# EAGLE design barriere_IR (EAGLE 6.1)
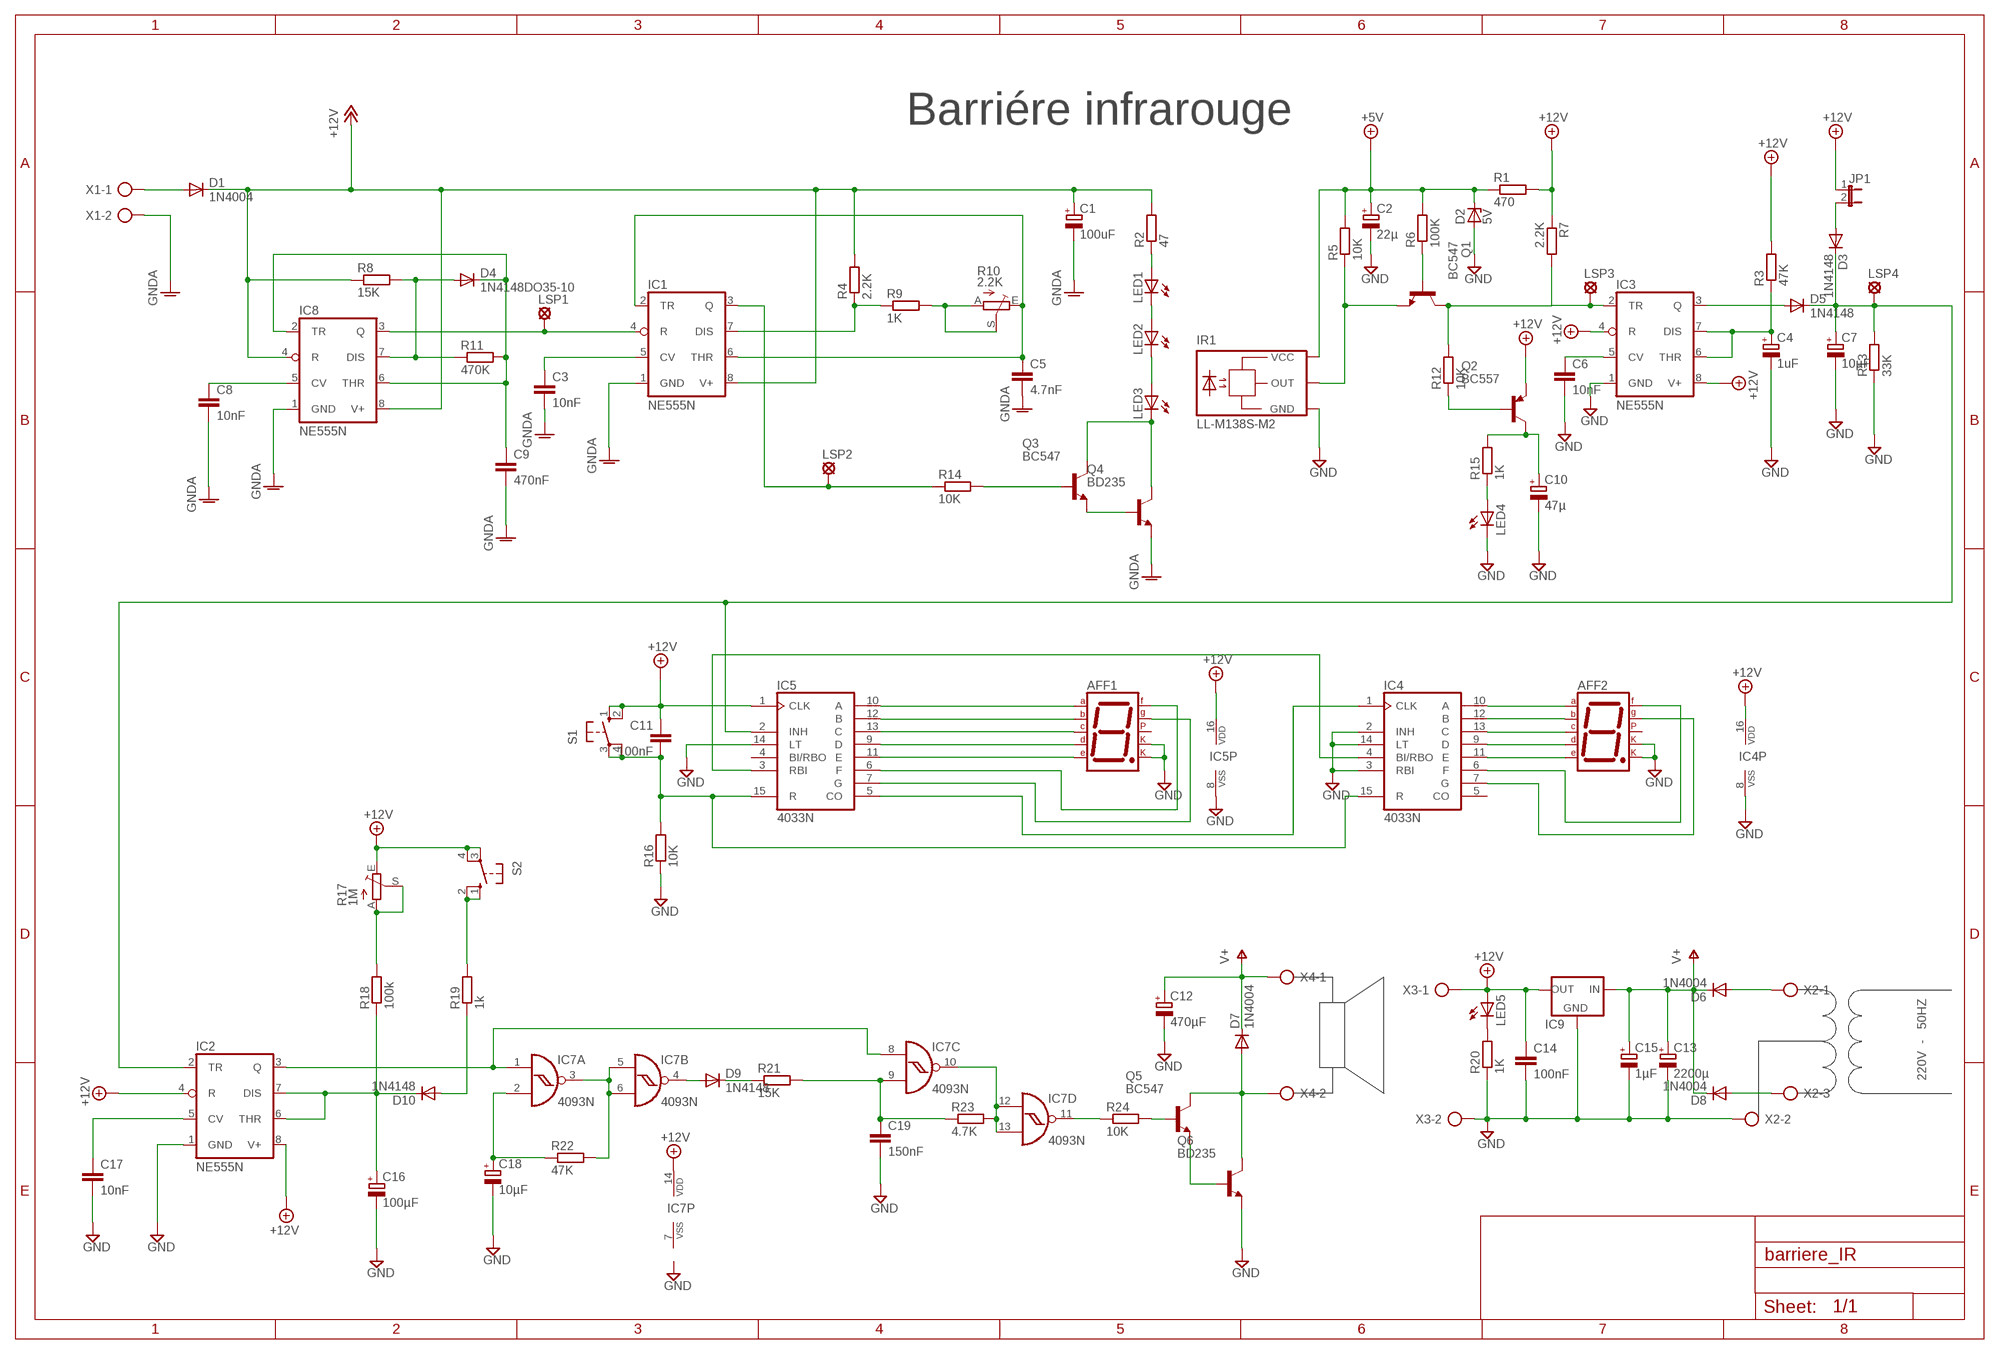
[diagram p0: schematic, sheet 1]

## Parts
AFF1  7SEG-CK  [7SEG-13]
AFF2  7SEG-CK  [7SEG-13]
C1  100uF  CPOL-EUE5-10.5  [E5-10,5]
C2  22µ  CPOL-EUE2.5-5  [E2,5-5]
C3  10nF  C-EU050-035X075  [C050-035X075]
C4  1uF  CPOL-EUE2.5-5  [E2,5-5]
C5  4.7nF  C-EU050-035X075  [C050-035X075]
C6  10nF  C-EU050-035X075  [C050-035X075]
C7  10µF  CPOL-EUE2.5-5  [E2,5-5]
C8  10nF  C-EU050-035X075  [C050-035X075]
C9  470nF  C-EU102-043X133  [C102-043X133]
C10  47µ  CPOL-EUE2.5-5  [E2,5-5]
C11  100nF  C-EU050-035X075  [C050-035X075]
C12  470µF  CPOL-EUE5-10.5  [E5-10,5]
C13  2200µ  CPOL-EUE5-13  [E5-13]
C14  100nF  C-EU050-030X075  [C050-030X075]
C15  1µF  CPOL-EUE2.5-5  [E2,5-5]
C16  100µF  CPOL-EUE5-10.5  [E5-10,5]
C17  10nF  C-EU050-035X075  [C050-035X075]
C18  10µF  CPOL-EUE2.5-5  [E2,5-5]
C19  150nF  C-EU050-035X075  [C050-035X075]
D1  1N4004  [DO41-10]
D2  5V  BZX90  [DO34Z7]
D3  1N4148  1N4148DO35-10  [DO35-10]
D4  1N4148DO35-10  [DO35-10]
D5  1N4148  1N4148DO35-10  [DO35-10]
D6  1N4004  [DO41-10]
D7  1N4004  [DO41-10]
D8  1N4004  [DO41-10]
D9  1N4148  1N4148DO35-10  [DO35-10]
D10  1N4148  1N4148DO35-10  [DO35-10]
IC1  NE555N  [DIL08]
IC2  NE555N  [DIL08]
IC3  NE555N  [DIL08]
IC4  4033N  [DIL16]
IC5  4033N  [DIL16]
IC7  4093N  [DIL14]
IC8  NE555N  [DIL08]
IC9  78XXS  [78XXS]
IR1  LL-M138S-M2  [LL-M138S-M2]
JP1  JP1E  [JP1]
LED1  LED5MM  [LED5MM]
LED2  LED5MM  [LED5MM]
LED3  LED5MM  [LED5MM]
LED4  LED5MM  [LED5MM]
LED5  LED5MM  [LED5MM]
LSP1  LSP10  [LSP10]
LSP2  LSP10  [LSP10]
LSP3  LSP10  [LSP10]
LSP4  LSP10  [LSP10]
Q1  BC547  [TO92]
Q2  BC557  [TO92]
Q3  BC547  [TO92]
Q4  BD235  [TO126]
Q5  BC547  [TO92]
Q6  BD235  [TO126]
R1  470  R-EU_0207/10  [0207/10]
R2  47  R-EU_0207/10  [0207/10]
R3  47K  R-EU_0207/10  [0207/10]
R4  2.2K  R-EU_0207/10  [0207/10]
R5  10K  R-EU_0207/10  [0207/10]
R6  100K  R-EU_0207/10  [0207/10]
R7  2.2K  R-EU_0207/10  [0207/10]
R8  15K  R-EU_0207/10  [0207/10]
R9  1K  R-EU_0207/10  [0207/10]
R10  2.2K  TRIM_EU-CA9V  [CA9V]
R11  470K  R-EU_0207/10  [0207/10]
R12  10K  R-EU_0207/10  [0207/10]
R13  33K  R-EU_0207/10  [0207/10]
R14  10K  R-EU_0207/10  [0207/10]
R15  1K  R-EU_0207/10  [0207/10]
R16  10K  R-EU_0207/10  [0207/10]
R17  1M  TRIM_EU-CA9V  [CA9V]
R18  100k  R-EU_0207/10  [0207/10]
R19  1k  R-EU_0207/10  [0207/10]
R20  1K  R-EU_0207/10  [0207/10]
R21  15K  R-EU_0207/10  [0207/10]
R22  47K  R-EU_0207/10  [0207/10]
R23  4.7K  R-EU_0207/10  [0207/10]
R24  10K  R-EU_0207/10  [0207/10]
S1  10-XX  [B3F-10XX]
S2  10-XX  [B3F-10XX]
X1  AK300/2  [AK300/2]
X2  AK300/3  [AK300/3]
X3  AK300/2  [AK300/2]
X4  AK300/2  [AK300/2]

## Nets
+5V: C2.+ D2.C IR1.3(VCC) R1.1 R5.2 R6.2
+12V: C11.1 C14.1 IC2.4(R) IC2.8(V+) IC3.4(R) IC3.8(V+) IC4.16(VDD) IC5.1(CLK) IC5.16(VDD) IC7.14(P:VDD) IC9.OUT JP1.1 LED5.A Q2.1(E) R1.2 R3.2 R7.1 R17.E S1.1(S) S1.2(S1) S2.3(P) S2.4(P1) X3.1
+12V/1: C1.+ D1.C IC1.8(V+) IC8.4(R) IC8.8(V+) R2.2 R4.2 R8.1 ; supply symbol labelled +12V
GND: AFF1.3(CK1) AFF1.8(CK2) AFF2.3(CK1) AFF2.8(CK2) C2.- C4.- C6.2 C7.- C10.- C12.- C13.- C14.2 C15.- C16.- C17.2 C18.- C19.2 D2.A IC2.1(GND) IC3.1(GND) IC4.2(INH) IC4.3(RBI) IC4.8(VSS) IC4.14(LT) IC5.8(VSS) IC5.14(LT) IC9.GND IR1.2(GND) LED4.K(C) Q6.1(E) R13.1 R16.1 R20.1 X2.2 X3.2
GNDA: C1.- C3.2 C5.2 C8.2 C9.2 IC1.1(GND) IC8.1(GND) Q4.1(E) X1.2
N$1: D1.A X1.1
N$2: D4.A IC8.7(DIS) R8.2 R11.1
N$3: IC1.3(Q) LSP2.MP R14.1
N$4: C9.1 D4.C IC8.2(TR) IC8.6(THR) R11.2
N$5: IC1.4(R) IC8.3(Q) LSP1.MP
N$6: C3.1 IC1.5(CV)
N$7: IC1.7(DIS) R4.1 R9.1
N$8: C8.1 IC8.5(CV)
N$9: R9.2 R10.A R10.S
N$10: IR1.1(OUT) Q1.1(E) R5.1
N$11: C5.1 IC1.2(TR) IC1.6(THR) R10.E
N$12: C6.1 IC3.5(CV)
N$13: LED1.A R2.1
N$14: LED1.K(C) LED2.A
N$15: LED2.K(C) LED3.A
N$16: LED3.K(C) Q3.3(C) Q4.2(C)
N$17: Q3.1(E) Q4.3(B)
N$18: Q3.2(B) R14.2
N$19: C4.+ IC3.6(THR) IC3.7(DIS) R3.1
N$20: D5.A IC3.3(Q)
N$21: IC3.2(TR) LSP3.MP Q1.3(C) R7.2 R12.2
N$22: Q1.2(B) R6.1
N$23: C7.+ D3.C D5.C IC2.2(TR) IC5.2(INH) LSP4.MP R13.2
N$24: D3.A JP1.2
N$25: Q2.2(B) R12.1
N$26: C10.+ Q2.3(C) R15.2
N$27: C11.2 IC4.15(R) IC5.15(R) R16.2 S1.3(P) S1.4(P1)
N$28: LED4.A R15.1
N$29: AFF1.7(A) IC5.10(A)
N$30: AFF1.6(B) IC5.12(B)
N$31: AFF1.4(C) IC5.13(C)
N$32: AFF1.2(D) IC5.9(D)
N$33: AFF1.1(E) IC5.11(E)
N$34: AFF1.9(F) IC5.6(F)
N$35: AFF1.10(G) IC5.7(G)
N$36: IC4.1(CLK) IC5.5(CO)
N$37: C17.1 IC2.5(CV)
N$38: AFF2.7(A) IC4.10(A)
N$39: IC4.4(BI/RBO) IC5.3(RBI)
N$40: AFF2.6(B) IC4.12(B)
N$41: AFF2.4(C) IC4.13(C)
N$42: AFF2.2(D) IC4.9(D)
N$43: AFF2.1(E) IC4.11(E)
N$44: AFF2.9(F) IC4.6(F)
N$45: AFF2.10(G) IC4.7(G)
N$46: C16.+ D10.C IC2.6(THR) IC2.7(DIS) R18.1
N$47: R19.2 S2.1(S) S2.2(S1)
N$48: R17.A R17.S R18.2
N$49: D10.A R19.1
N$50: C18.+ IC7.2(A:I1) R22.1
N$51: IC2.3(Q) IC7.1(A:I0) IC7.8(C:I0)
N$52: IC7.3(A:O) IC7.5(B:I0) IC7.6(B:I1) R22.2
N$54: D9.A IC7.4(B:O)
N$55: D9.C R21.1
N$56: C19.1 IC7.9(C:I1) R21.2 R23.1
N$57: IC7.10(C:O) IC7.12(D:I0) IC7.13(D:I1) R23.2
N$60: IC7.11(D:O) R24.1
N$61: Q5.2(B) R24.2
N$62: Q5.1(E) Q6.3(B)
N$63: D7.A Q5.3(C) Q6.2(C) X4.2
N$66: LED5.K(C) R20.2
N$75: D8.A X2.3
N$76: D6.A X2.1
V+: C12.+ C13.+ C15.+ D6.C D7.C D8.C IC9.IN X4.1
Unconnected: AFF1.5(DP) AFF2.5(DP) IC4.5(CO) IC5.4(BI/RBO)

## Notes on the sheet
- Barriére infrarouge
- 220V  -   50HZ

## Power pins joined to a net without a drawn wire
VSS: IC7.7(P:VSS)

## Library data of the parts
AFF1 AFF2 = special:7SEG-CK: 7-segment DISPLAY single cathode, 13 mm
C1 C2 C4 C7 C10 C12 C13 C15 C16 C18 = rcl:CPOL-EU: POLARIZED CAPACITOR, European symbol
C3 C5 C6 C8 C9 C11 C14 C17 C19 = rcl:C-EU: CAPACITOR, European symbol
D1 D6-D8 = diode:1N4004: DIODE general purpose rectifier, 1 A
D2 = diode:BZX90: Z DIODE
D3-D5 D9 D10 = diode:1N4148: DIODE high speed (Philips)
IC1-IC3 IC8 = linear:*555: TIMER
IC4 IC5 = 40xx:4033: Decade COUNTER/DIVIDER, 7-seg. outputs
IC7 = 40xx:4093: Quad 2-input NAND schmitt trigger
IC9 = v-reg:78XXS: VOLTAGE REGULATOR
IR1 = Luckylight:LL-M138S-M2: Infrared Receiver Module Source: http://www.luckylight.cn/UploadFiles/cn_b_9_42.pdf
JP1 = jumper:JP1E: JUMPER
LED1-LED5 = led:LED: LED OSRAM: - CHIPLED LG R971, LG N971, LY N971, LG Q971, LY Q971, LO R971, LY R971 LH N974, LH R974 LS Q976, LO Q976, LY Q976 LO Q996 - Hyper CHIPLED LW Q18S LB Q993, LB Q99A, LB R99A - SideLED LS A670, LO A670, LY A670, LG A670, LP A670 LB A673, LV A673, LT A673, LW A673 LH A674 LY A675 LS A676, LA A676, LO A676, LY A676, LW A676 LS A679, LY A679, LG A679 - Hyper Micro SIDELED® LS Y876, LA Y876, LO Y876, LY Y876 LT Y87S - SmartLED LW L88C, LW L88S LB L89C, LB L89S, LG L890 LS L89K, LO L89K, LY L89K LS L896, LA L896, LO L896, LY L896 - TOPLED LS T670, LO T670, LY T670, LG T670, LP T670 LSG T670, LSP T670, LSY T670, LOP T670, LYG T670 LG T671, LOG T671, LSG T671 LB T673, LV T673, LT T673, LW T673 LH T674 LS T676, LA T676, LO T676, LY T676, LB T676, LH T676, LSB T676, LW T676 LB T67C, LV T67C, LT T67C, LS T67K, LO T67K, LY T67K, LW E67C LS E67B, LA E67B, LO E67B, LY E67B, LB E67C, LV E67C, LT E67C LW T67C LS T679, LY T679, LG T679 LS T770, LO T770, LY T770, LG T770, LP T770 LB T773, LV T773, LT T773, LW T773 LH T774 LS E675, LA E675, LY E675, LS T675 LS T776, LA T776, LO T776, LY T776, LB T776 LHGB T686 LT T68C, LB T68C - Hyper Mini TOPLED® LB M676 - Mini TOPLED Santana® LG M470 LS M47K, LO M47K, LY M47K Source: http://www.osram.convergy.de LUXEON: - LUMILED® LXK2-PW12-R00, LXK2-PW12-S00, LXK2-PW14-U00, LXK2-PW14-V00 LXK2-PM12-R00, LXK2-PM12-S00, LXK2-PM14-U00 LXK2-PE12-Q00, LXK2-PE12-R00, LXK2-PE12-S00, LXK2-PE14-T00, LXK2-PE14-U00 LXK2-PB12-K00, LXK2-PB12-L00, LXK2-PB12-M00, LXK2-PB14-N00, LXK2-PB14-P00, LXK2-PB14-Q00 LXK2-PR12-L00, LXK2-PR12-M00, LXK2-PR14-Q00, LXK2-PR14-R00 LXK2-PD12-Q00, LXK2-PD12-R00, LXK2-PD12-S00 LXK2-PH12-R00, LXK2-PH12-S00 LXK2-PL12-P00, LXK2-PL12-Q00, LXK2-PL12-R00 Source: www.luxeon.com KINGBRIGHT: KA-3528ASYC Source: www.kingbright.com
LSP1-LSP4 = solpad:LSP10: SOLDER PAD drill 1.0 mm, distributor Buerklin, 12H555
Q1 Q3 Q5 = transistor:BC547: NPN TRANSISTOR
Q2 = transistor-pnp:BC557: PNP Transistor
Q4 Q6 = transistor:BD235: NPN TRANSISTOR
R1-R9 R11-R16 R18-R24 = rcl:R-EU_: RESISTOR, European symbol
R10 R17 = pot:TRIM_EU-: POTENTIOMETER
S1 S2 = switch-omron:10-XX: OMRON SWITCH; MPN: B3F-1000; OC_FARNELL: 176432; OC_NEWARK: 36M3542
X1 X3 X4 = con-ptr500:AK300/2: CONNECTOR; OC_FARNELL: unknown; OC_NEWARK: unknown
X2 = con-ptr500:AK300/3: CONNECTOR; OC_FARNELL: unknown; OC_NEWARK: unknown

## Board
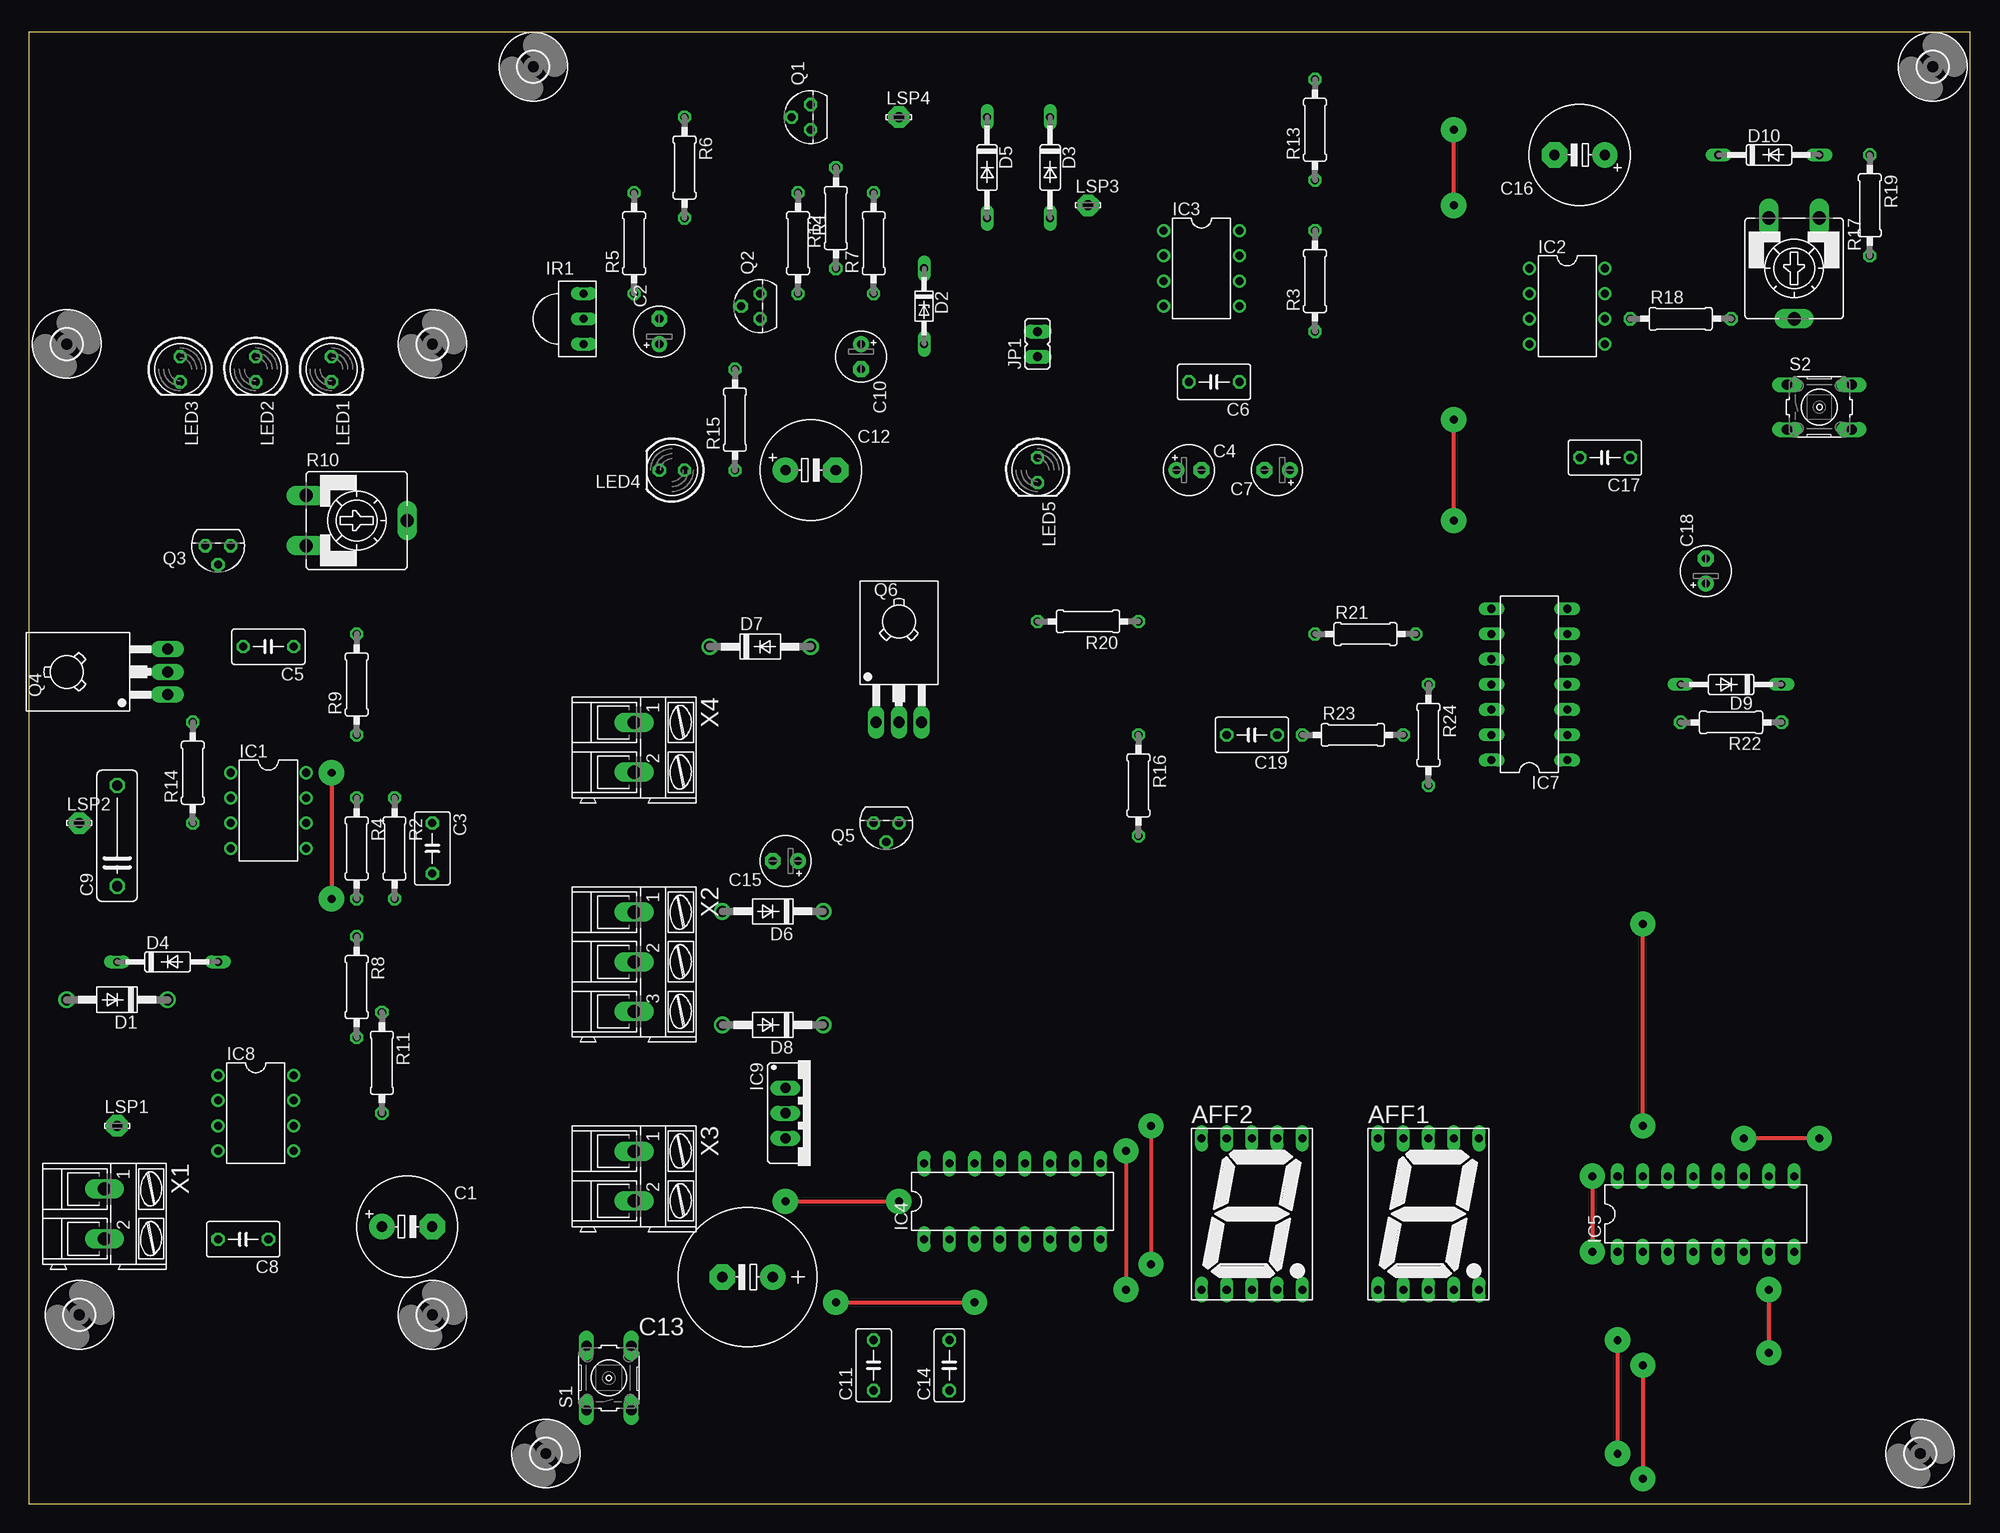
[diagram p1: board, top side]
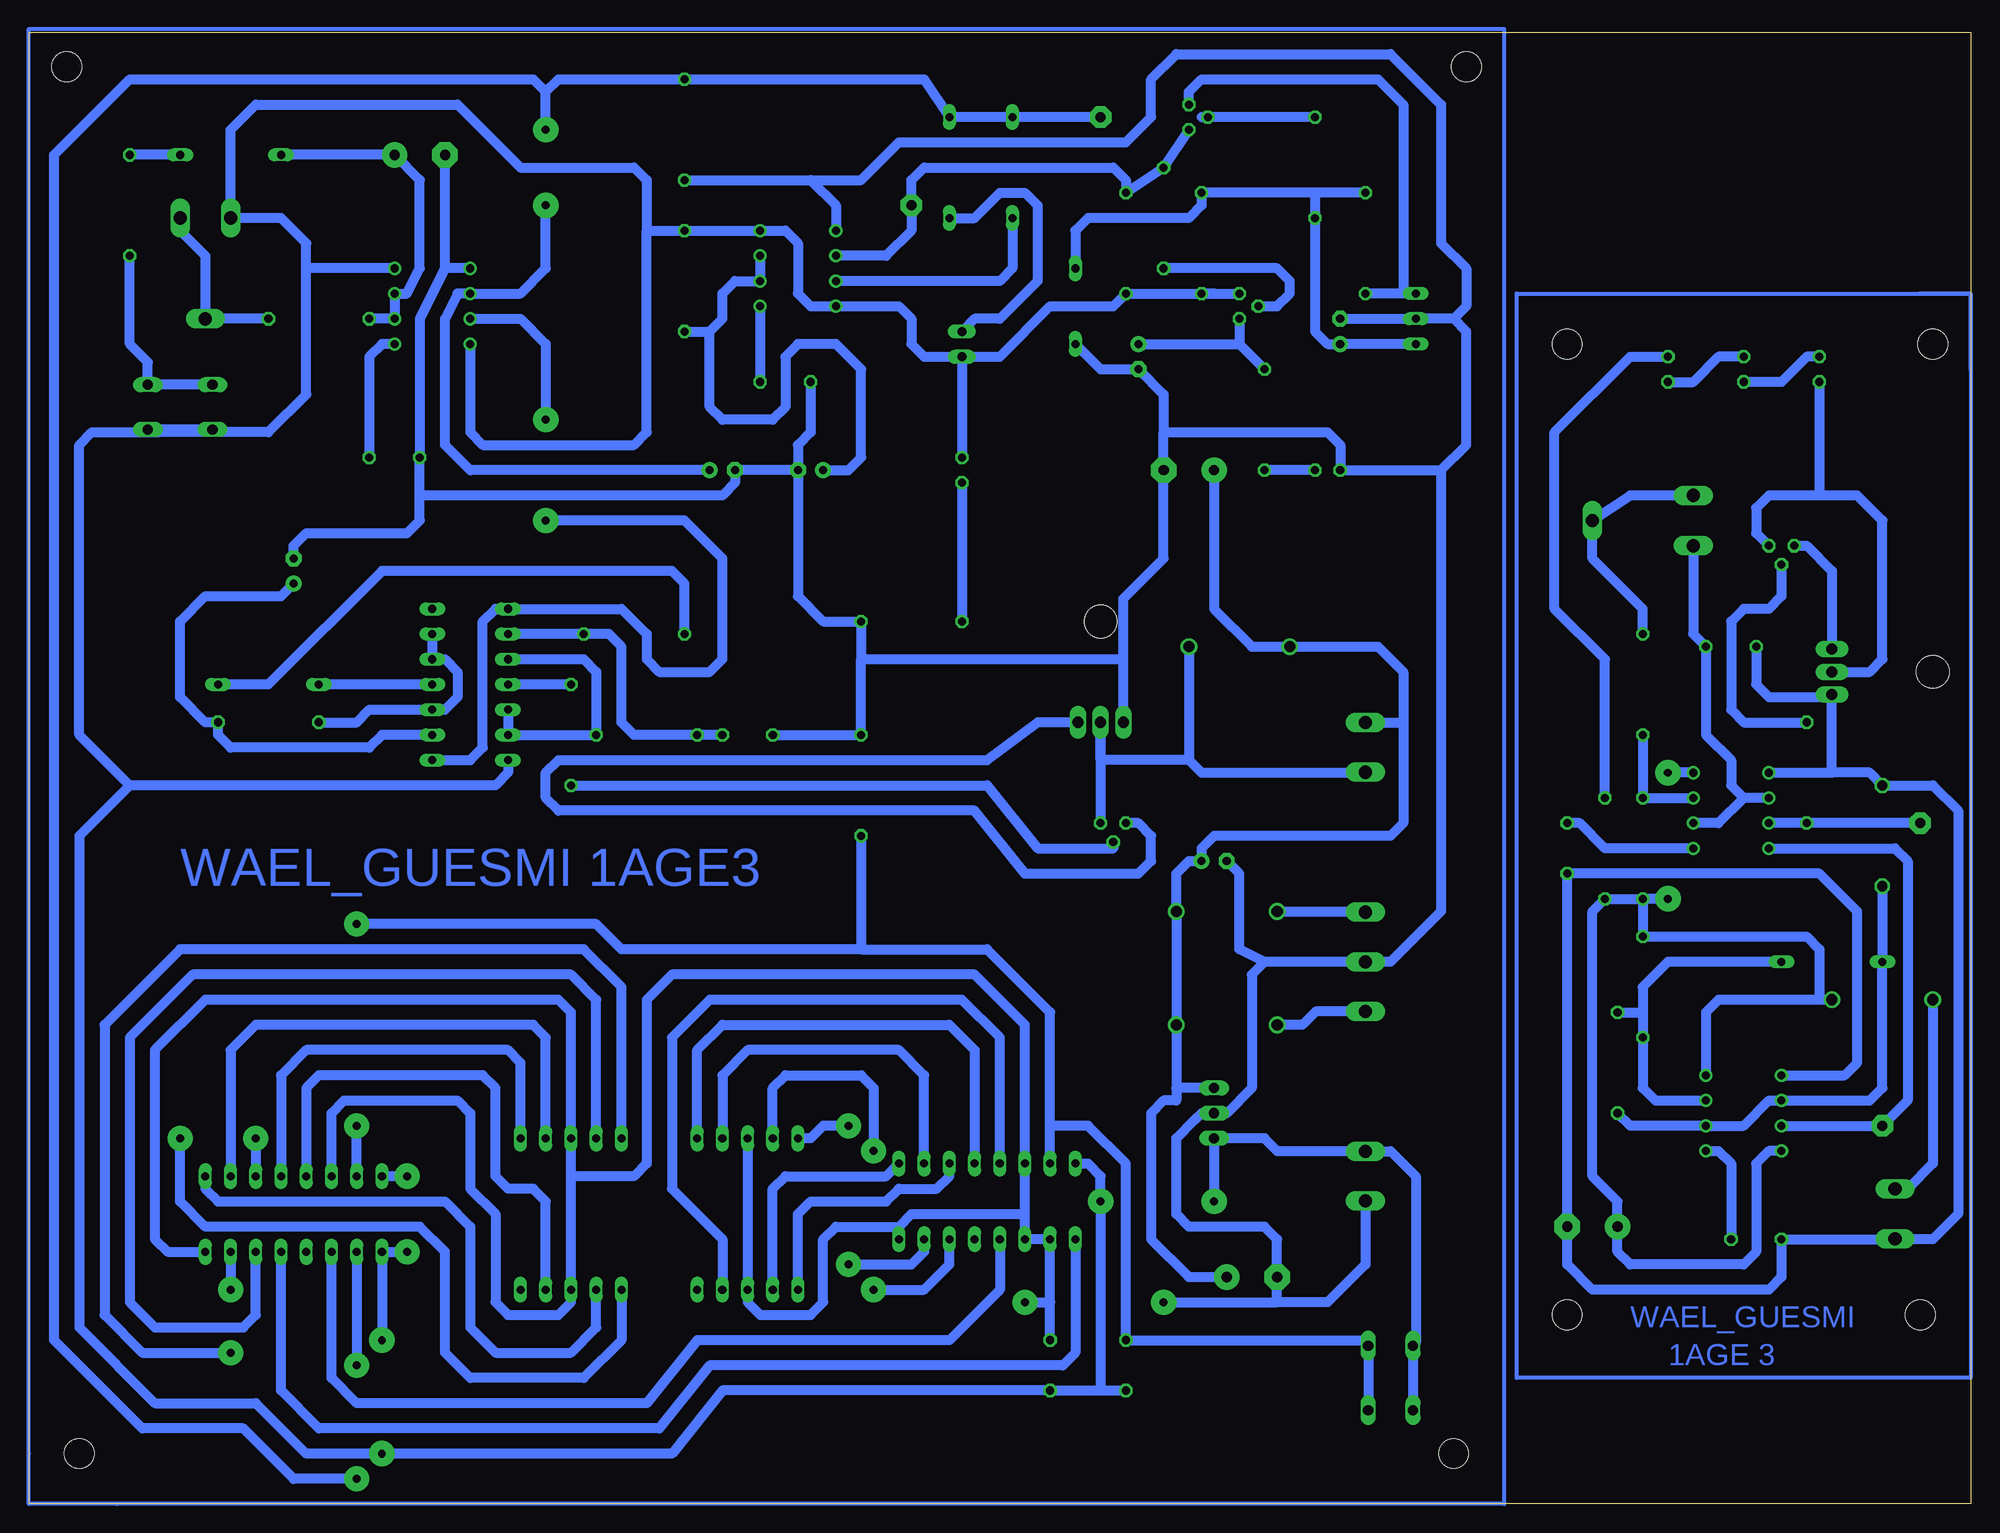
[diagram p2: board, bottom side, seen from below]

Size 195.56 x 148.26 mm. Coordinates in mm from the lower left corner, seen from the top.
Outline: 0,0 195.56,0 195.56,148.26 0,148.26 0,0
Copper layers (1*16): Top 0.035mm / dielectric 1.5mm / Bottom 0.035mm
Design rules: minimum track width 10mil, minimum drill 24mil, track to track 8mil, track to pad 8mil, pad to pad 8mil, via to via 8mil, smd to smd 8mil, copper to edge 40mil, drill to drill 8mil, minimum pad ring 10mil, minimum via ring 8mil, stop-mask expansion 4mil, vias tented up to drill 0mil, thermal gap 10mil

### Footprints (pad centres in the part's own frame; a part is rotated, then mirrored left to right if it is on the bottom)
7SEG-13 = drill 0.813 long: 1 -5.08,-7.62; 2 -2.54,-7.62; 3 0,-7.62; 4 2.54,-7.62; 5 5.08,-7.62; 6 5.08,7.62; 7 2.54,7.62; 8 0,7.62; 9 -2.54,7.62; 10 -5.08,7.62
E5-10,5 = drill 1.016 pad 2.54: + -2.54,0 | drill 1.016 pad 2.54 octagon: - 2.54,0
E2,5-5 = drill 0.813 pad 1.6: + -1.27,0 | drill 0.813 pad 1.6 octagon: - 1.27,0
C050-035X075 = drill 0.813 octagon: 1 -2.54,0; 2 2.54,0
C102-043X133 = drill 1.016 octagon: 1 -5.08,0; 2 5.08,0
E5-13 = drill 1.016 pad 2.54: + -2.54,0 | drill 1.016 pad 2.54 octagon: - 2.54,0
C050-030X075 = drill 0.813 octagon: 1 -2.54,0; 2 2.54,0
DO41-10 = drill 1.118: A 5.08,0; C -5.08,0
DO34Z7 = drill 0.813 long: A 3.81,0; C -3.81,0
DO35-10 = drill 0.813 long: A 5.08,0; C -5.08,0
DIL08 = drill 0.813 pad 1.27: 1 -3.81,-3.81; 2 -1.27,-3.81; 3 1.27,-3.81; 4 3.81,-3.81; 5 3.81,3.81; 6 1.27,3.81; 7 -1.27,3.81; 8 -3.81,3.81
DIL16 = drill 0.813 long: 1 -8.89,-3.81; 2 -6.35,-3.81; 3 -3.81,-3.81; 4 -1.27,-3.81; 5 1.27,-3.81; 6 3.81,-3.81; 7 6.35,-3.81; 8 8.89,-3.81; 9 8.89,3.81; 10 6.35,3.81; 11 3.81,3.81; 12 1.27,3.81; 13 -1.27,3.81; 14 -3.81,3.81; 15 -6.35,3.81; 16 -8.89,3.81
DIL14 = drill 0.813 long: 1 -7.62,-3.81; 2 -5.08,-3.81; 3 -2.54,-3.81; 4 0,-3.81; 5 2.54,-3.81; 6 5.08,-3.81; 7 7.62,-3.81; 8 7.62,3.81; 9 5.08,3.81; 10 2.54,3.81; 11 0,3.81; 12 -2.54,3.81; 13 -5.08,3.81; 14 -7.62,3.81
78XXS = drill 1.016 long: GND 0,-2.54; IN -2.54,-2.54; OUT 2.54,-2.54
LL-M138S-M2 = drill 0.8 long: 1 -2.54,0; 2 0,0; 3 2.54,0
JP1 = drill 0.914 long: 1 0,-1.27; 2 0,1.27
LED5MM = drill 0.813 octagon: A -1.27,0; K 1.27,0
LSP10 = drill 1.016 pad 2.159 octagon: MP 0,0
TO92 = drill 0.813 octagon: 1 1.27,0; 2 0,1.905; 3 -1.27,0
TO126 = drill 1.118 long: 1 -2.286,-5.08; 2 0,-5.08; 3 2.286,-5.08 | hole 3.302: 0,5.08
0207/10 = drill 0.813 octagon: 1 -5.08,0; 2 5.08,0
CA9V = drill 1.321 long: A -2.54,-5.08; E 2.54,-5.08; S 0,5.08
B3F-10XX = drill 1.016 long: 1 -3.251,2.261; 2 3.251,2.261; 3 -3.251,-2.261; 4 3.251,-2.261
3,0 = hole 3: 0,0
AK300/2 = drill 1.321 long: 1 -2.515,0; 2 2.489,0
AK300/3 = drill 1.321 long: 1 -5.004,0; 2 0,0; 3 5.004,0

### Placement (x,y rotation side)
AFF1  140.97,29.21 0 top
AFF2  123.19,29.21 0 top
C1  38.1,27.94 0 top
C2  63.5,118.11 90 top
C3  40.64,66.04 270 top
C4  116.84,104.14 0 top
C5  24.13,86.36 180 top
C6  119.38,113.03 180 top
C7  125.73,104.14 180 top
C8  21.59,26.67 180 top
C9  8.89,67.31 90 top
C10  83.82,115.57 270 top
C11  85.09,13.97 90 top
C12  78.74,104.14 0 top
C13  72.39,22.86 180 top
C14  92.71,13.97 90 top
C15  76.2,64.77 180 top
C16  156.21,135.89 180 top
C17  158.75,105.41 180 top
C18  168.91,93.98 90 top
C19  123.19,77.47 180 top
D1  8.89,50.8 180 top
D2  90.17,120.65 270 top
D3  102.87,134.62 270 top
D4  13.97,54.61 0 top
D5  96.52,134.62 270 top
D6  74.93,59.69 180 top
D7  73.66,86.36 0 top
D8  74.93,48.26 180 top
D9  171.45,82.55 180 top
D10  175.26,135.89 0 top
IC1  24.13,69.85 270 top
IC2  154.94,120.65 270 top
IC3  118.11,124.46 270 top
IC4  99.06,30.48 0 top
IC5  168.91,29.21 0 top
IC7  151.13,82.55 90 top
IC8  22.86,39.37 270 top
IC9  78.74,39.37 270 top
IR1  55.88,119.38 270 top
JP1  101.6,116.84 0 top
LED1  30.48,114.3 270 top
LED2  22.86,114.3 270 top
LED3  15.24,114.3 270 top
LED4  64.77,104.14 180 top
LED5  101.6,104.14 270 top
LSP1  8.89,38.1 0 top
LSP2  5.08,68.58 0 top
LSP3  106.68,130.81 0 top
LSP4  87.63,139.7 0 top
Q1  78.74,139.7 90 top
Q2  73.66,120.65 90 top
Q3  19.05,96.52 180 top
Q4  8.89,83.82 90 top
Q5  86.36,68.58 180 top
Q6  87.63,83.82 0 top
R1  77.47,127 270 top
R2  36.83,66.04 270 top
R3  129.54,123.19 90 top
R4  33.02,66.04 270 top
R5  60.96,127 90 top
R6  66.04,134.62 270 top
R7  85.09,127 90 top
R8  33.02,52.07 270 top
R9  33.02,82.55 90 top
R10  33.02,99.06 270 top
R11  35.56,44.45 270 top
R12  81.28,129.54 90 top
R13  129.54,138.43 90 top
R14  16.51,73.66 90 top
R15  71.12,109.22 90 top
R16  111.76,72.39 270 top
R17  177.8,124.46 180 top
R18  166.37,119.38 0 top
R19  185.42,130.81 270 top
R20  106.68,88.9 180 top
R21  134.62,87.63 0 top
R22  171.45,78.74 180 top
R23  133.35,77.47 0 top
R24  140.97,77.47 270 top
S1  58.42,12.7 90 top
S2  180.34,110.49 0 top
U$1  [3,0]  40.64,19.05 0 top
U$2  [3,0]  5.08,19.05 0 top
U$3  [3,0]  3.81,116.84 0 top
U$4  [3,0]  40.64,116.84 0 top
U$5  [3,0]  50.8,144.78 0 top
U$6  [3,0]  191.77,144.78 0 top
U$7  [3,0]  190.5,5.08 0 top
U$8  [3,0]  52.07,5.08 0 top
X1  7.62,29.21 270 top
X2  60.96,54.61 270 top
X3  60.96,33.02 270 top
X4  60.96,76.2 270 top

### Tracks (layer width: path | path; a pad name or v marks a point on that pad's centre or on a via)
+5V
  Bottom 1.016: IR1.3 C2.+ 64.77,116.84 66.04,118.11 R6.2 66.04,132.08 | D2.C 90.17,128.27 88.9,129.54 78.74,129.54 77.47,130.81 R1.1 66.04,132.08 | R5.2 66.04,132.08
+12V  (via drill 0.8 pad 2.54)
  Top 0.406: v76.2,30.48 v87.63,30.48 | v160.02,16.51 v160.02,5.08 | v157.48,33.02 v157.48,25.4
  Bottom 1.016: v157.48,25.4 IC5.1 v160.02,16.51 | v157.48,33.02 IC5.16 | 87.63,11.43 C14.1 125.73,11.43 130.81,5.08 v160.02,5.08 167.64,5.08 172.72,10.16 182.88,10.16 190.5,17.78 190.5,67.31 185.42,72.39 | 87.63,11.43 C11.1 | IC7.14 147.32,73.66 148.59,72.39 185.42,72.39 | 185.42,72.39 190.5,77.47 190.5,106.68 189.23,107.95 182.6,107.95 | 182.6,107.95 S2.3 S2.4 | 182.6,107.95 171.45,107.95 167.64,111.76 167.64,124.46 | JP1.1 105.41,115.57 106.68,116.84 106.68,119.38 107.95,120.65 IC3.4 116.84,120.65 118.11,121.92 118.11,127 119.38,128.27 IC3.8 R3.2 133.35,128.27 | JP1.1 LED5.A | JP1.1 97.79,115.57 92.71,120.65 86.36,120.65 R7.1 R1.2 | 76.2,121.92 R1.2 | R1.2 Q2.1 | S1.1 S1.2 55.88,16.23 55.88,33.02 58.4,35.53 X3.1 69.83,35.53 71.12,36.83 IC9.OUT v76.2,30.48 | IC4.16 88.9,34.29 87.63,33.02 v87.63,30.48 87.63,11.43 | IC2.4 151.13,107.95 149.86,106.68 134.62,106.68 133.35,107.95 133.35,128.27 | IC2.8 167.64,124.46 | 167.64,124.46 167.64,127 170.18,129.54 R17.E 175.26,138.43 172.72,140.97 152.4,140.97 146.05,134.62 134.62,134.62 133.35,133.35 133.35,128.27
+12V/1  (via drill 0.8 pad 2.54)
  Top 0.406: v30.48,73.66 v30.48,60.96
  Bottom 1.016: IC8.4 20.32,35.56 21.59,34.29 21.59,25.4 22.86,24.13 34.29,24.13 35.56,25.4 C1.+ 35.56,30.48 38.1,33.02 38.1,59.69 R2.2 R4.2 | D1.C 15.24,50.8 | IC8.8 26.67,49.53 25.4,50.8 15.24,50.8 | 15.24,50.8 15.24,55.88 16.51,57.15 R8.1 R4.2 | IC1.8 v30.48,73.66 | v30.48,60.96 R4.2
GND  (via drill 0.8 pad 2.54)
  Top 0.406: v81.28,20.32 v95.25,20.32
  Bottom 1.016: IC5.8 181.61,25.4 182.88,26.67 182.88,45.72 177.8,50.8 142.24,50.8 140.97,49.53 AFF1.8 140.97,33.02 | 140.97,33.02 AFF1.3 140.97,20.32 142.24,19.05 147.32,19.05 148.59,20.32 148.59,29.21 151.13,31.75 151.13,39.37 152.4,40.64 163.83,40.64 165.1,39.37 IC5.14 | 95.25,29.21 IC4.14 95.25,48.26 100.33,53.34 130.81,53.34 133.35,50.8 133.35,34.29 134.62,33.02 140.97,33.02 | C14.2 92.71,20.32 | 92.71,20.32 IC4.2 IC4.3 95.25,29.21 | 107.95,27.94 IC4.8 | C18.- 168.91,96.52 167.64,97.79 157.48,97.79 156.21,99.06 C17.2 | IC2.1 153.67,124.46 | 153.67,124.46 156.21,119.38 C17.2 | IC3.1 114.3,130.81 116.84,133.35 R13.1 111.76,133.35 107.95,137.16 85.09,137.16 82.55,139.7 82.55,143.51 80.01,146.05 58.42,146.05 53.34,140.97 53.34,127 50.8,124.46 50.8,120.65 52.07,119.38 | 153.67,124.46 C16.- | C2.- IR1.2 52.07,119.38 | C6.2 116.84,107.95 118.11,106.68 C4.- | C4.- C7.- 124.46,102.87 125.73,101.6 156.21,101.6 C17.2 | C4.- 118.11,91.44 115.57,88.9 R20.1 111.76,85.09 | 85.34,85.09 85.34,91.19 81.28,95.25 C12.- 81.28,107.95 | D2.A 87.63,114.3 C10.- 81.28,111.76 81.28,107.95 | 53.34,104.14 50.8,106.68 50.8,118.11 52.07,119.38 | 111.76,85.09 R16.1 C19.2 | 111.76,85.09 85.34,85.09 | 71.12,54.61 X2.2 58.42,54.61 53.34,59.69 53.34,104.14 | 71.12,54.61 73.66,55.88 73.66,63.5 C15.- | Q6.1 85.34,85.09 | 81.28,107.95 64.77,107.95 63.5,106.68 LED4.K 53.34,104.14 | 71.12,54.61 72.39,53.34 72.39,41.91 74.93,39.37 IC9.GND 77.47,39.37 78.11,38.73 80.01,36.83 80.01,29.21 78.74,27.94 71.12,27.94 69.85,26.67 C13.- 69.85,20.32 | X3.2 60.96,24.13 64.77,20.32 69.85,20.32 | v95.25,20.32 92.71,20.32
  Bottom 1.016: AFF2.8 AFF2.3 123.19,20.32 121.92,19.05 116.84,19.05 115.57,20.32 115.57,26.67 114.3,27.94 107.95,27.94 | 107.95,27.94 106.68,29.21 95.25,29.21 | v81.28,20.32 69.85,20.32
GNDA
  Bottom 1.016: IC1.1 13.97,73.66 | C5.2 21.59,82.55 20.32,81.28 14.22,81.28 Q4.1 13.97,73.66 | 13.97,73.66 10.16,73.66 C9.2 3.81,72.39 1.27,69.85 1.27,29.21 3.81,26.67 7.57,26.67 X1.2 7.67,26.67 C8.2 19.05,22.86 20.32,21.59 38.1,21.59 40.64,24.13 C1.- C3.2 15.24,63.5 11.43,59.69 11.43,44.45 12.7,43.18 IC8.1
N$1
  Bottom 1.016: D1.A 3.81,34.29 6.35,31.75 7.59,31.75 X1.1
N$2
  Bottom 1.016: D4.A 30.48,54.61 33.02,52.07 33.02,49.53 | 33.02,49.53 R8.2 33.02,41.91 31.75,40.64 IC8.7 | R11.1 33.02,49.53
N$3
  Bottom 1.016: LSP2.MP R14.1 IC1.3
N$4
  Bottom 1.016: C9.1 D4.C 8.89,41.91 10.16,40.64 IC8.2 20.32,40.64 22.86,38.1 IC8.6 34.29,38.1 R11.2
N$5
  Bottom 1.016: IC8.3 LSP1.MP 6.35,40.64 6.35,64.77 7.62,66.04 IC1.4
N$6
  Bottom 1.016: IC1.5 36.83,66.04 39.37,68.58 C3.1
N$7
  Bottom 1.016: IC1.7 R4.1 R9.1
N$8
  Bottom 1.016: IC8.5 25.4,35.56 24.13,34.29 C8.1
N$9
  Bottom 1.016: R10.A 34.29,101.6 R10.S 38.1,95.25 33.02,90.17 R9.2
N$10
  Bottom 1.016: IR1.1 57.15,121.92 | 57.15,121.92 R5.1 | Q1.1 78.74,142.24 77.47,143.51 59.69,143.51 57.15,140.97 57.15,121.92
N$11
  Bottom 1.016: R10.E 27.94,87.63 C5.1 26.67,77.47 24.13,74.93 24.13,72.39 22.86,71.12 | IC1.2 22.86,71.12 | 22.86,71.12 25.4,68.58 IC1.6
N$12
  Bottom 1.016: IC3.5 C6.1
N$13
  Bottom 1.016: R2.1 36.83,85.09 41.91,90.17 41.91,107.95 34.29,115.57 LED1.A
N$14
  Bottom 1.016: LED1.K 27.94,113.03 25.4,115.57 LED2.A
N$15
  Bottom 1.016: LED3.A 16.51,115.57 19.05,113.03 LED2.K
N$16
  Bottom 1.016: LED3.K 15.24,101.6 | Q3.3 21.59,97.79 21.59,100.33 20.32,101.6 15.24,101.6 | Q4.2 10.16,83.82 8.89,85.09 8.89,99.06 11.43,101.6 15.24,101.6
N$17
  Bottom 1.016: Q3.1 16.51,96.52 13.97,93.98 Q4.3
N$18
  Bottom 1.016: Q3.2 19.05,91.44 20.32,90.17 22.86,90.17 24.13,88.9 24.13,80.01 22.86,78.74 R14.2
N$19
  Bottom 1.016: R3.1 127,118.11 | 127,118.11 125.73,119.38 125.73,121.92 124.46,123.19 IC3.6 IC3.7 | C4.+ 113.03,104.14 111.76,105.41 111.76,114.3 114.3,116.84 118.11,116.84 119.38,115.57 119.38,110.49 120.65,109.22 125.73,109.22 127,110.49 127,118.11
N$20
  Bottom 1.016: D5.A 96.52,124.46 97.79,123.19 IC3.3
N$21
  Bottom 1.016: Q1.3 R12.2 R7.2 85.09,133.35 86.36,134.62 105.41,134.62 106.68,133.35 LSP3.MP 106.68,128.27 109.22,125.73 IC3.2
N$22
  Bottom 1.016: R6.1 Q1.2 77.47,139.7
N$23  (via drill 0.8 pad 2.54)
  Top 0.406: v143.51,130.81 v143.51,138.43 | v162.56,13.97 v162.56,2.54
  Bottom 1.016: v143.51,130.81 143.51,124.46 146.05,121.92 IC2.2 152.4,121.92 153.67,119.38 153.67,106.68 151.13,104.14 C7.+ | v143.51,138.43 143.51,142.24 | 143.51,142.24 142.24,143.51 R13.2 105.41,143.51 D3.C D5.C LSP4.MP | IC5.2 v162.56,13.97 | v162.56,2.54 168.91,2.54 173.99,7.62 184.15,7.62 193.04,16.51 193.04,135.89 185.42,143.51 144.78,143.51 143.51,142.24
N$24
  Bottom 1.016: D3.A 100.33,129.54 97.79,132.08 95.25,132.08 93.98,130.81 93.98,123.19 97.79,119.38 100.33,119.38 JP1.2
N$25
  Bottom 1.016: R12.1 69.85,124.46 68.58,123.19 68.58,121.92 69.85,120.65 Q2.2
N$26
  Bottom 1.016: Q2.3 73.66,116.84 | 73.66,116.84 R15.2 | C10.+ 73.66,116.84
N$27  (via drill 0.8 pad 2.54)
  Top 0.406: v162.56,38.1 v162.56,58.42
  Bottom 1.016: 92.71,38.1 88.9,38.1 85.09,34.29 C11.2 61.24,16.51 S1.4 S1.3 | IC4.15 92.71,38.1 | 92.71,38.1 92.71,49.53 99.06,55.88 111.76,55.88 | 111.76,55.88 135.89,55.88 138.43,58.42 v162.56,58.42 | R16.2 111.76,55.88 | IC5.15 v162.56,38.1
N$28
  Bottom 1.016: LED4.A R15.1
N$29
  Bottom 1.016: AFF1.7 143.51,46.99 144.78,48.26 172.72,48.26 175.26,45.72 IC5.10
N$30
  Bottom 1.016: AFF1.6 146.05,44.45 147.32,45.72 167.64,45.72 170.18,43.18 IC5.12
N$31
  Bottom 1.016: AFF1.4 143.51,30.48 144.78,31.75 147.32,31.75 148.59,33.02 148.59,41.91 149.86,43.18 166.37,43.18 167.64,41.91 IC5.13
N$32
  Bottom 1.016: IC5.9 177.8,31.75 176.53,30.48 153.67,30.48 151.13,27.94 151.13,17.78 148.59,15.24 140.97,15.24 138.43,17.78 AFF1.2
N$33  (via drill 0.8 pad 2.54)
  Top 0.406: v180.34,36.83 v172.72,36.83
  Bottom 1.016: AFF1.1 135.89,16.51 139.7,12.7 151.13,12.7 153.67,15.24 153.67,25.4 156.21,27.94 177.8,27.94 180.34,30.48 v180.34,36.83 | v172.72,36.83 IC5.11
N$34
  Bottom 1.016: AFF1.9 138.43,50.8 140.97,53.34 179.07,53.34 185.42,46.99 185.42,20.32 182.88,17.78 173.99,17.78 172.72,19.05 IC5.6
N$35  (via drill 0.8 pad 2.54)
  Top 0.406: v175.26,21.59 v175.26,15.24
  Bottom 1.016: AFF1.10 135.89,52.07 139.7,55.88 180.34,55.88 187.96,48.26 187.96,19.05 184.15,15.24 v175.26,15.24 | IC5.7 v175.26,21.59
N$36
  Bottom 1.016: IC4.1 90.17,15.24 91.44,13.97 127,13.97 132.08,7.62 166.37,7.62 170.18,11.43 IC5.5
N$37
  Bottom 1.016: IC2.5 160.02,116.84 161.29,115.57 C17.1
N$38
  Bottom 1.016: IC4.10 105.41,43.18 107.95,45.72 123.19,45.72 125.73,43.18 AFF2.7
N$39
  Bottom 1.016: IC4.4 97.79,21.59 102.87,16.51 128.27,16.51 133.35,10.16 162.56,10.16 165.1,12.7 IC5.3
N$40
  Bottom 1.016: AFF2.6 128.27,45.72 125.73,48.26 102.87,48.26 100.33,45.72 IC4.12
N$41
  Bottom 1.016: IC4.13 97.79,46.99 101.6,50.8 127,50.8 130.81,46.99 130.81,31.75 125.73,26.67 AFF2.4
N$42
  Bottom 1.016: AFF2.2 120.65,31.75 119.38,33.02 109.22,33.02 IC4.9
N$43
  Bottom 1.016: AFF2.1 118.11,29.21 116.84,30.48 109.22,30.48 107.95,31.75 104.14,31.75 102.87,33.02 IC4.11
N$44  (via drill 0.8 pad 2.54)
  Top 0.406: v110.49,35.56 v110.49,21.59
  Bottom 1.016: AFF2.9 120.65,41.91 119.38,43.18 111.76,43.18 110.49,41.91 v110.49,35.56 | v110.49,21.59 105.41,21.59 102.87,24.13 IC4.6
N$45  (via drill 0.8 pad 2.54)
  Top 0.406: v113.03,38.1 v113.03,24.13
  Bottom 1.016: v113.03,24.13 106.68,24.13 105.41,25.4 IC4.7 | v113.03,38.1 115.57,38.1 116.84,36.83 AFF2.10
N$46
  Bottom 1.016: R18.1 IC2.6 IC2.7 157.48,121.92 156.21,124.46 156.21,133.35 C16.+ D10.C
N$47
  Bottom 1.016: R19.2 185.42,116.84 183.59,115.01 S2.2 S2.1
N$48
  Bottom 1.016: R18.2 R17.S 177.8,125.73 180.34,128.27 R17.A
N$49
  Bottom 1.016: D10.A R19.1
N$50
  Bottom 1.016: C18.+ 170.18,91.44 177.8,91.44 180.34,88.9 180.34,81.28 177.8,78.74 R22.1 176.53,77.47 175.26,76.2 161.29,76.2 160.02,77.47 IC7.2
N$51  (via drill 0.8 pad 2.54)
  Top 0.406: v143.51,99.06 v143.51,109.22
  Bottom 1.016: IC7.1 151.13,74.93 149.86,76.2 149.86,88.9 148.59,90.17 IC7.8 135.89,90.17 133.35,87.63 133.35,85.09 132.08,83.82 127,83.82 125.73,85.09 125.73,95.25 129.54,99.06 v143.51,99.06 | IC2.3 146.05,119.38 143.51,116.84 v143.51,109.22
N$52
  Bottom 1.016: R22.2 162.56,78.74 161.29,80.01 IC7.3 153.67,80.01 152.4,81.28 152.4,83.82 153.67,85.09 IC7.5 IC7.6
N$54
  Bottom 1.016: IC7.4 D9.A
N$55
  Bottom 1.016: R21.1 129.54,92.71 130.81,93.98 160.02,93.98 171.45,82.55 D9.C
N$56
  Bottom 1.016: IC7.9 R21.2 137.16,87.63 135.89,86.36 135.89,78.74 134.62,77.47 R23.1 C19.1
N$57
  Bottom 1.016: IC7.10 139.7,85.09 138.43,83.82 R23.2 IC7.13 IC7.12
N$58  (via drill 0.8 pad 2.54)
  other vias: 5.08,19.05
N$59  (via drill 0.8 pad 2.54)
  other vias: 40.64,19.05
N$60
  Bottom 1.016: R24.1 IC7.11
N$61
  Bottom 1.016: R24.2 99.06,72.39 93.98,66.04 86.36,66.04 Q5.2
N$62
  Bottom 1.016: Q6.3 93.98,78.74 99.06,74.93 142.24,74.93 143.51,73.66 143.51,71.12 142.24,69.85 100.33,69.85 95.25,63.5 83.82,63.5 82.55,64.77 82.55,67.31 83.82,68.58 Q5.1
N$63
  Bottom 1.016: D7.A 78.74,74.93 | 78.74,74.93 77.47,73.66 62.28,73.66 X4.2 | 78.74,74.93 87.63,74.93 Q6.2 Q5.3
N$64  (via drill 0.8 pad 2.54)
  other vias: 3.81,116.84
N$65  (via drill 0.8 pad 2.54)
  other vias: 40.64,116.84
N$66
  Bottom 1.016: LED5.K R20.2
N$67  (via drill 0.8 pad 2.54)
  other vias: 50.8,144.78
N$68  (via drill 0.8 pad 2.54)
  other vias: 191.77,144.78
N$69  (via drill 0.8 pad 2.54)
  other vias: 190.5,5.08
N$70  (via drill 0.8 pad 2.54)
  other vias: 52.07,5.08
N$71
  Bottom 0.406: 186.69,0 195.58,0 195.58,5.08
N$72
  Bottom 0.406: 46.99,148.59 46.99,0 195.58,0 195.58,148.59 46.99,148.59
N$75
  Bottom 1.016: X2.3 65.96,49.61 67.31,48.26 D8.A
N$76
  Bottom 1.016: X2.1 69.77,59.61 D6.A
N$78
  Bottom 0.406: 0,114.3 0,121.92 5.08,121.92
N$79
  Bottom 0.406: 45.72,121.92 0,121.92 0,12.7 45.72,12.7 45.72,121.92
V+
  Bottom 1.016: C12.+ 76.2,90.17 72.39,86.36 D7.C 59.69,86.36 57.15,83.82 57.15,78.74 | X4.1 57.15,78.74 | 57.15,78.74 57.15,68.58 58.42,67.31 76.2,67.31 77.47,66.04 C15.+ 78.74,64.77 80.01,63.5 D6.C D8.C 80.01,41.91 | 80.01,41.91 80.01,40.64 81.28,40.64 82.55,39.37 82.55,26.67 78.74,22.86 C13.+ | IC9.IN 80.01,41.91

### Text on the board
Bottom: WAEL_GUESMI 1AGE3 | WAEL_GUESMI | 1AGE 3